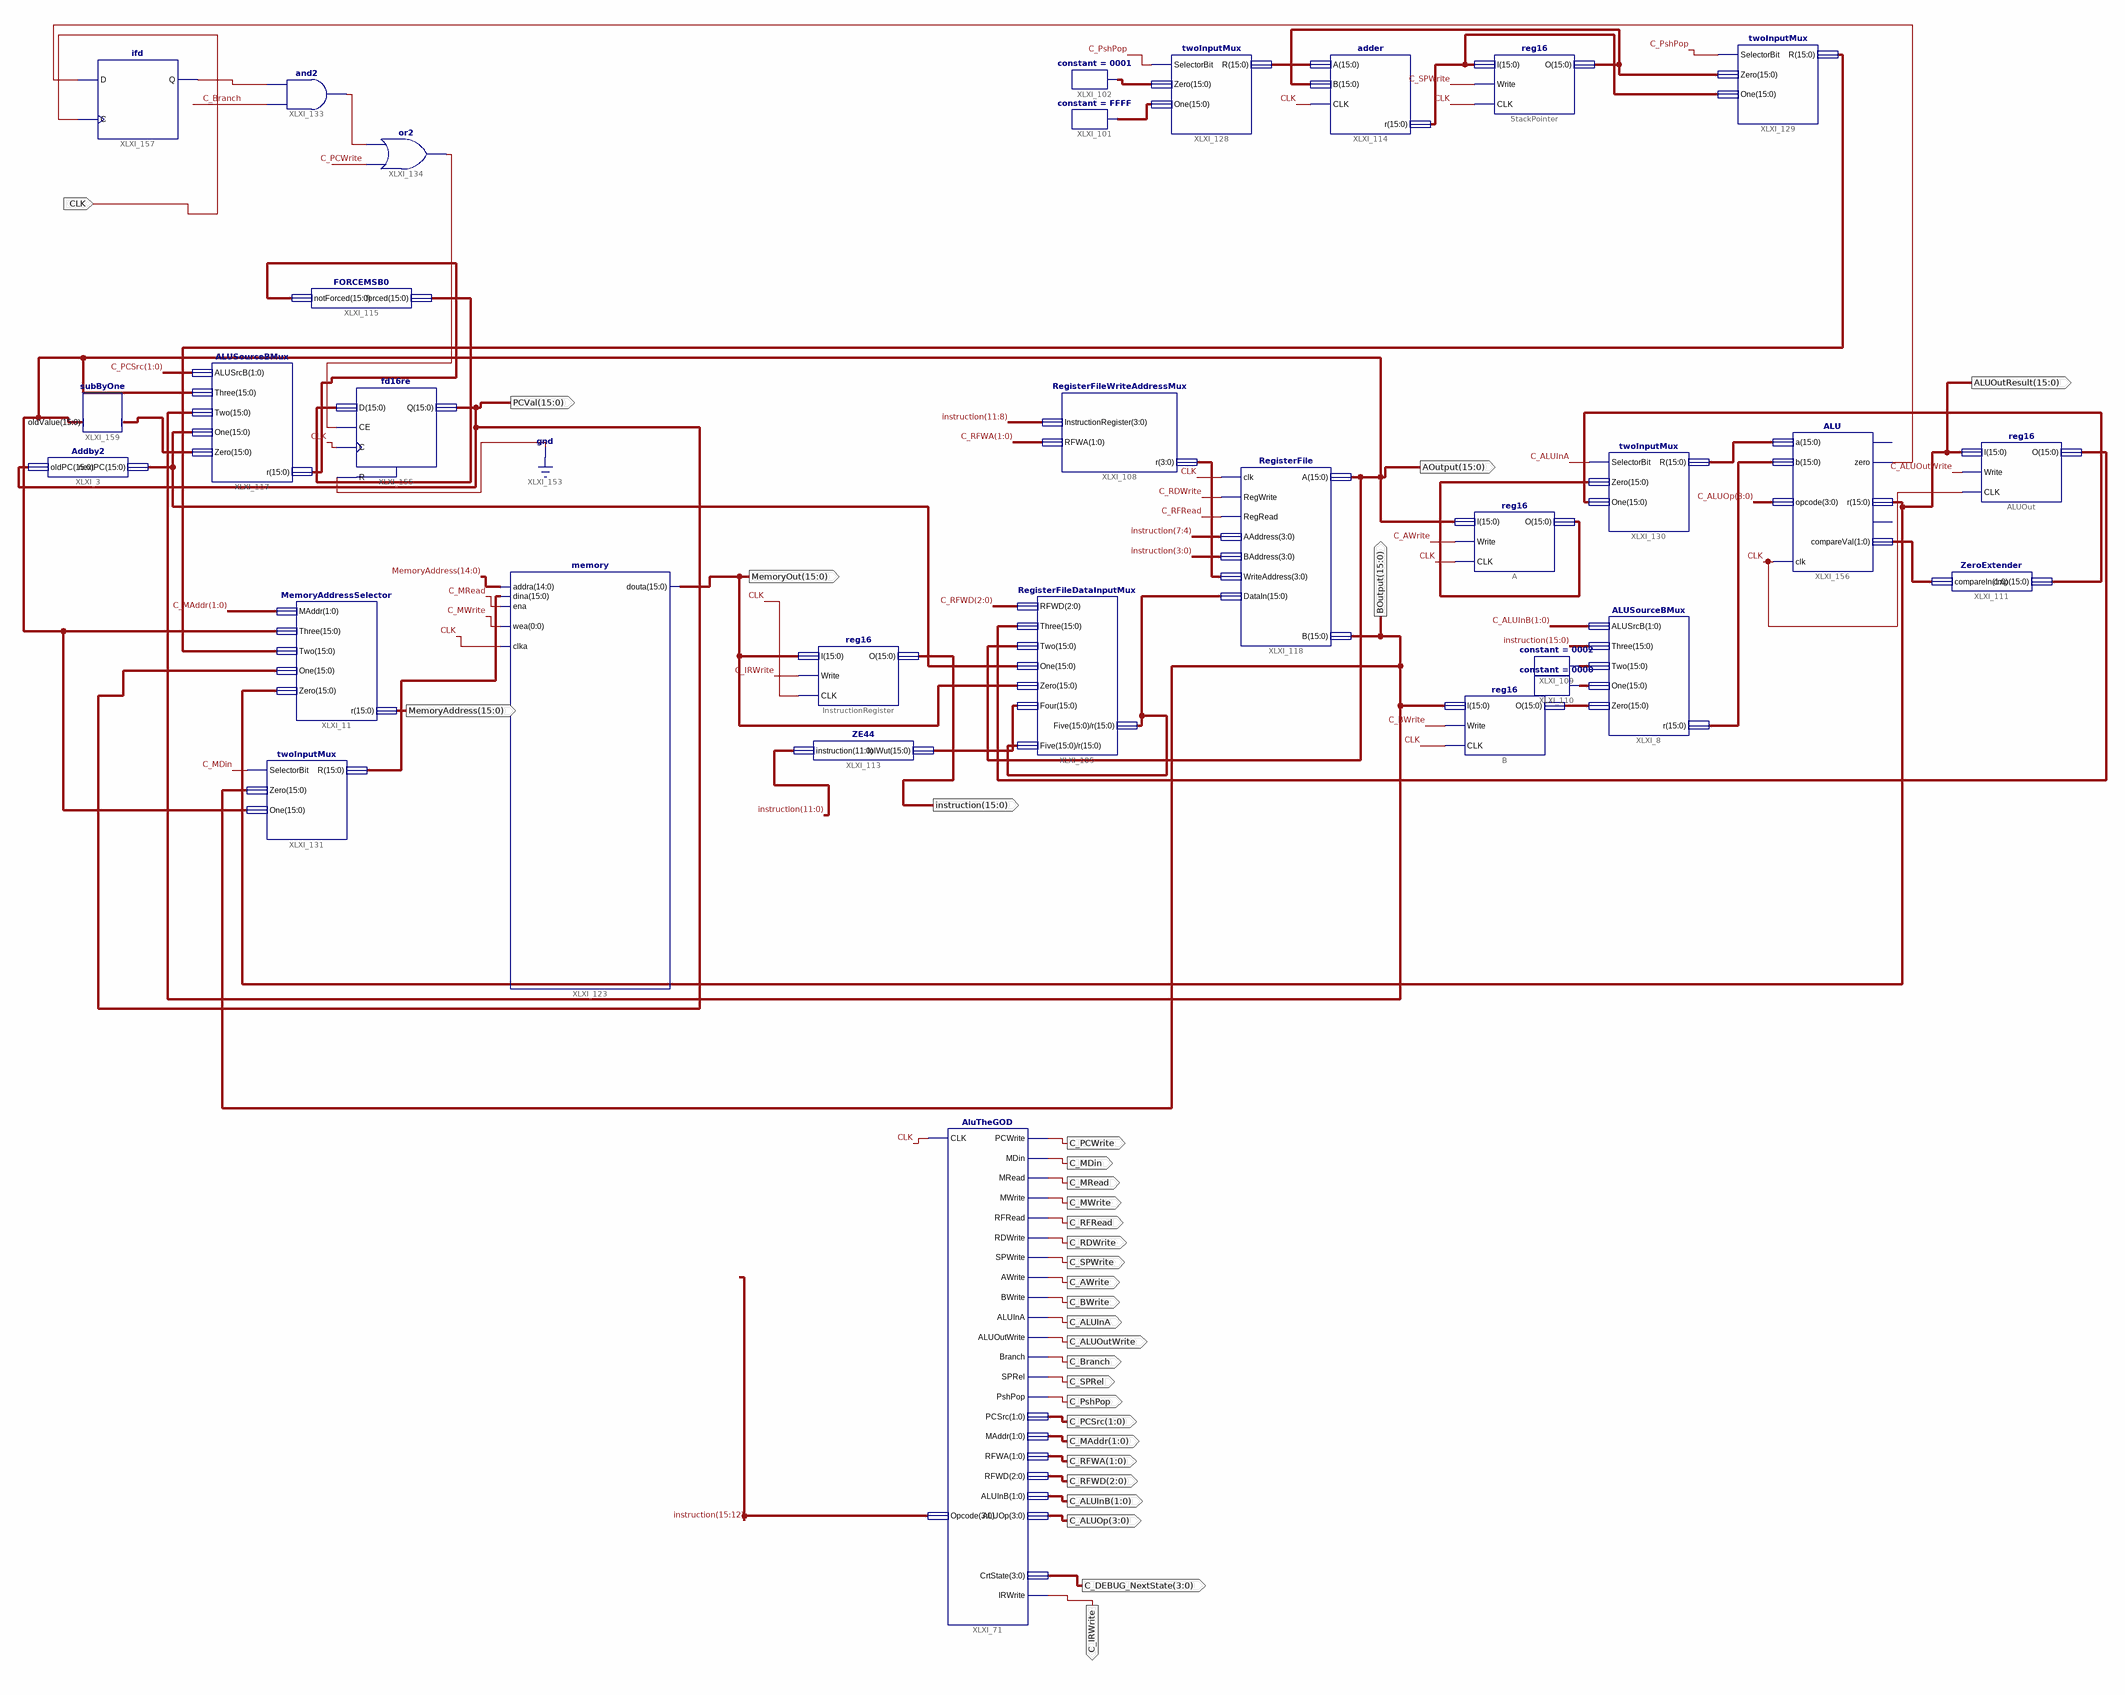
[diagram p0: schematic sheet 1]
// Xilinx ISE schematic TopLevel.sch (spartan3e) as structural Verilog: 32 symbols, 31 ports
module TopLevel (
  input  CLK,
  output [15:0] instruction,
  output C_PCWrite,
  output C_MDin,
  output C_MRead,
  output C_MWrite,
  output C_RFRead,
  output C_RDWrite,
  output C_SPWrite,
  output C_AWrite,
  output C_BWrite,
  output C_ALUInA,
  output C_ALUOutWrite,
  output C_Branch,
  output C_SPRel,
  output C_PshPop,
  output [1:0] C_PCSrc,
  output [1:0] C_MAddr,
  output [1:0] C_RFWA,
  output [1:0] C_ALUInB,
  output [3:0] C_ALUOp,
  output [3:0] C_DEBUG_NextState,
  output [2:0] C_RFWD,
  output [15:0] MemoryOut,
  output [15:0] MemoryAddress,
  output [15:0] XLXN_185,
  output [15:0] ALUOutResult,
  output C_IRWrite,
  output [15:0] AOutput,
  output [15:0] PCVal,
  output [15:0] BOutput
);

  wire XLXN_191, XLXN_199, XLXN_234, ZERO;
  wire [1:0] XLXN_216;
  wire [3:0] XLXN_8;
  wire [15:0] cmp, XLXN_7, XLXN_10, XLXN_20, XLXN_66, XLXN_68, XLXN_69, XLXN_77, XLXN_79, XLXN_110, XLXN_111,
       XLXN_115, XLXN_116, XLXN_147, XLXN_148, XLXN_151, XLXN_187, XLXN_188, XLXN_232, XLXN_233;

  reg16 StackPointer (.I(XLXN_69), .Write(C_SPWrite), .CLK(CLK), .O(XLXN_66));
  ALUSourceBMux XLXI_8 (
    .ALUSrcB(C_ALUInB), .Three(instruction), .Two(XLXN_116), .One(XLXN_115), .Zero(XLXN_20), .r(XLXN_151));
  reg16 B (.I(BOutput), .Write(C_BWrite), .CLK(CLK), .O(XLXN_20));
  reg16 A (.I(AOutput), .Write(C_AWrite), .CLK(CLK), .O(XLXN_147));
  AluTheGOD XLXI_71 (
    .CLK(CLK), .Opcode(instruction[15:12]), .PCWrite(C_PCWrite), .MDin(C_MDin), .MRead(C_MRead),
    .MWrite(C_MWrite), .RFRead(C_RFRead), .RDWrite(C_RDWrite), .SPWrite(C_SPWrite), .AWrite(C_AWrite),
    .BWrite(C_BWrite), .ALUInA(C_ALUInA), .ALUOutWrite(C_ALUOutWrite), .Branch(C_Branch), .SPRel(C_SPRel),
    .PshPop(C_PshPop), .IRWrite(C_IRWrite), .PCSrc(C_PCSrc), .MAddr(C_MAddr), .RFWA(C_RFWA), .RFWD(C_RFWD),
    .ALUInB(C_ALUInB), .ALUOp(C_ALUOp), .CrtState(C_DEBUG_NextState));
  Addby2 XLXI_3 (.oldPC(PCVal), .nextPC(XLXN_10));
  reg16 InstructionRegister (.I(MemoryOut), .Write(C_IRWrite), .CLK(CLK), .O(instruction));
  MemoryAddressSelector XLXI_11 (
    .MAddr(C_MAddr), .Three(AOutput), .Two(XLXN_185), .One(PCVal), .Zero(ALUOutResult), .r(MemoryAddress));
  constant #(.CValue("FFFF")) XLXI_101 (.O(XLXN_79));
  constant #(.CValue("0001")) XLXI_102 (.O(XLXN_77));
  RegisterFileDataInputMux XLXI_105 (
    .RFWD(C_RFWD), .Five(XLXN_7), .Four(XLXN_111), .Three(XLXN_110), .Two(AOutput), .One(XLXN_10),
    .Zero(MemoryOut), .r(XLXN_7));
  RegisterFileWriteAddressMux XLXI_108 (.RFWA(C_RFWA), .InstructionRegister(instruction[11:8]), .r(XLXN_8));
  constant #(.CValue("0002")) XLXI_109 (.O(XLXN_116));
  constant #(.CValue("0000")) XLXI_110 (.O(XLXN_115));
  ZeroExtender XLXI_111 (.compareIn(XLXN_216), .cmp(cmp));
  ZE44 XLXI_113 (.instruction(instruction[11:0]), .lolWut(XLXN_111));
  adder XLXI_114 (.CLK(CLK), .A(XLXN_68), .B(XLXN_66), .r(XLXN_69));
  FORCEMSB0 XLXI_115 (.notForced(XLXN_148), .forced(XLXN_232));
  ALUSourceBMux XLXI_117 (
    .ALUSrcB(C_PCSrc), .Three(AOutput), .Two(BOutput), .One(XLXN_10), .Zero(XLXN_233), .r(XLXN_148));
  RegisterFile XLXI_118 (
    .clk(CLK), .RegWrite(C_RDWrite), .RegRead(C_RFRead), .AAddress(instruction[7:4]),
    .BAddress(instruction[3:0]), .WriteAddress(XLXN_8), .DataIn(XLXN_7), .A(AOutput), .B(BOutput));
  memory XLXI_123 (
    .addra(MemoryAddress[14:0]), .dina(XLXN_188), .ena(C_MRead), .wea(C_MWrite), .clka(CLK), .douta(MemoryOut));
  twoInputMux XLXI_128 (.SelectorBit(C_PshPop), .Zero(XLXN_77), .One(XLXN_79), .R(XLXN_68));
  twoInputMux XLXI_129 (.SelectorBit(C_PshPop), .Zero(XLXN_66), .One(XLXN_69), .R(XLXN_185));
  twoInputMux XLXI_130 (.SelectorBit(C_ALUInA), .Zero(XLXN_147), .One(cmp), .R(XLXN_187));
  and XLXI_133 (XLXN_199, C_Branch, XLXN_234);
  or XLXI_134 (XLXN_191, C_PCWrite, XLXN_199);
  fd16re XLXI_155 (.C(CLK), .CE(XLXN_191), .D(XLXN_232), .R(1'b0), .Q(PCVal));
  twoInputMux XLXI_131 (.SelectorBit(C_MDin), .Zero(BOutput), .One(AOutput), .R(XLXN_188));
  ALU XLXI_156 (
    .clk(CLK), .a(XLXN_187), .b(XLXN_151), .opcode(C_ALUOp), .zero(ZERO), .r(ALUOutResult),
    .compareVal(XLXN_216));  // open: cout, error
  ifd XLXI_157 (.C(CLK), .D(ZERO), .Q(XLXN_234));
  reg16 ALUOut (.I(ALUOutResult), .Write(C_ALUOutWrite), .CLK(CLK), .O(XLXN_110));
  subByOne XLXI_159 (.oldValue(AOutput));  // open: result
endmodule
